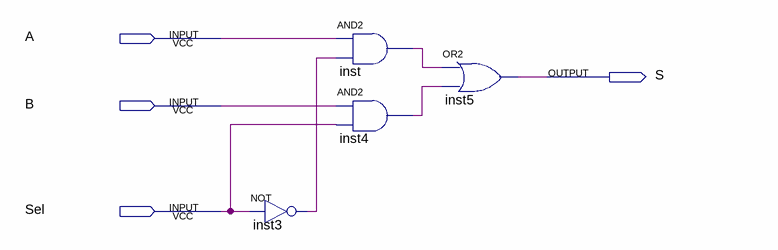
[diagram p0: schematic sheet]
// Quartus schematic mux_2x1.bdf as structural Verilog: 4 symbols, 4 pins
module mux_2x1 (
  input  A,
  input  B,
  input  Sel,
  output S
);

  wire inst3_out, inst4_out, inst_out;

  not inst3 (inst3_out, Sel);
  and inst (inst_out, A, inst3_out);
  and inst4 (inst4_out, B, Sel);
  or inst5 (S, inst_out, inst4_out);
endmodule
